# EAGLE schematic protestSign (EAGLE 6.4)

## Sheet 1 of 5
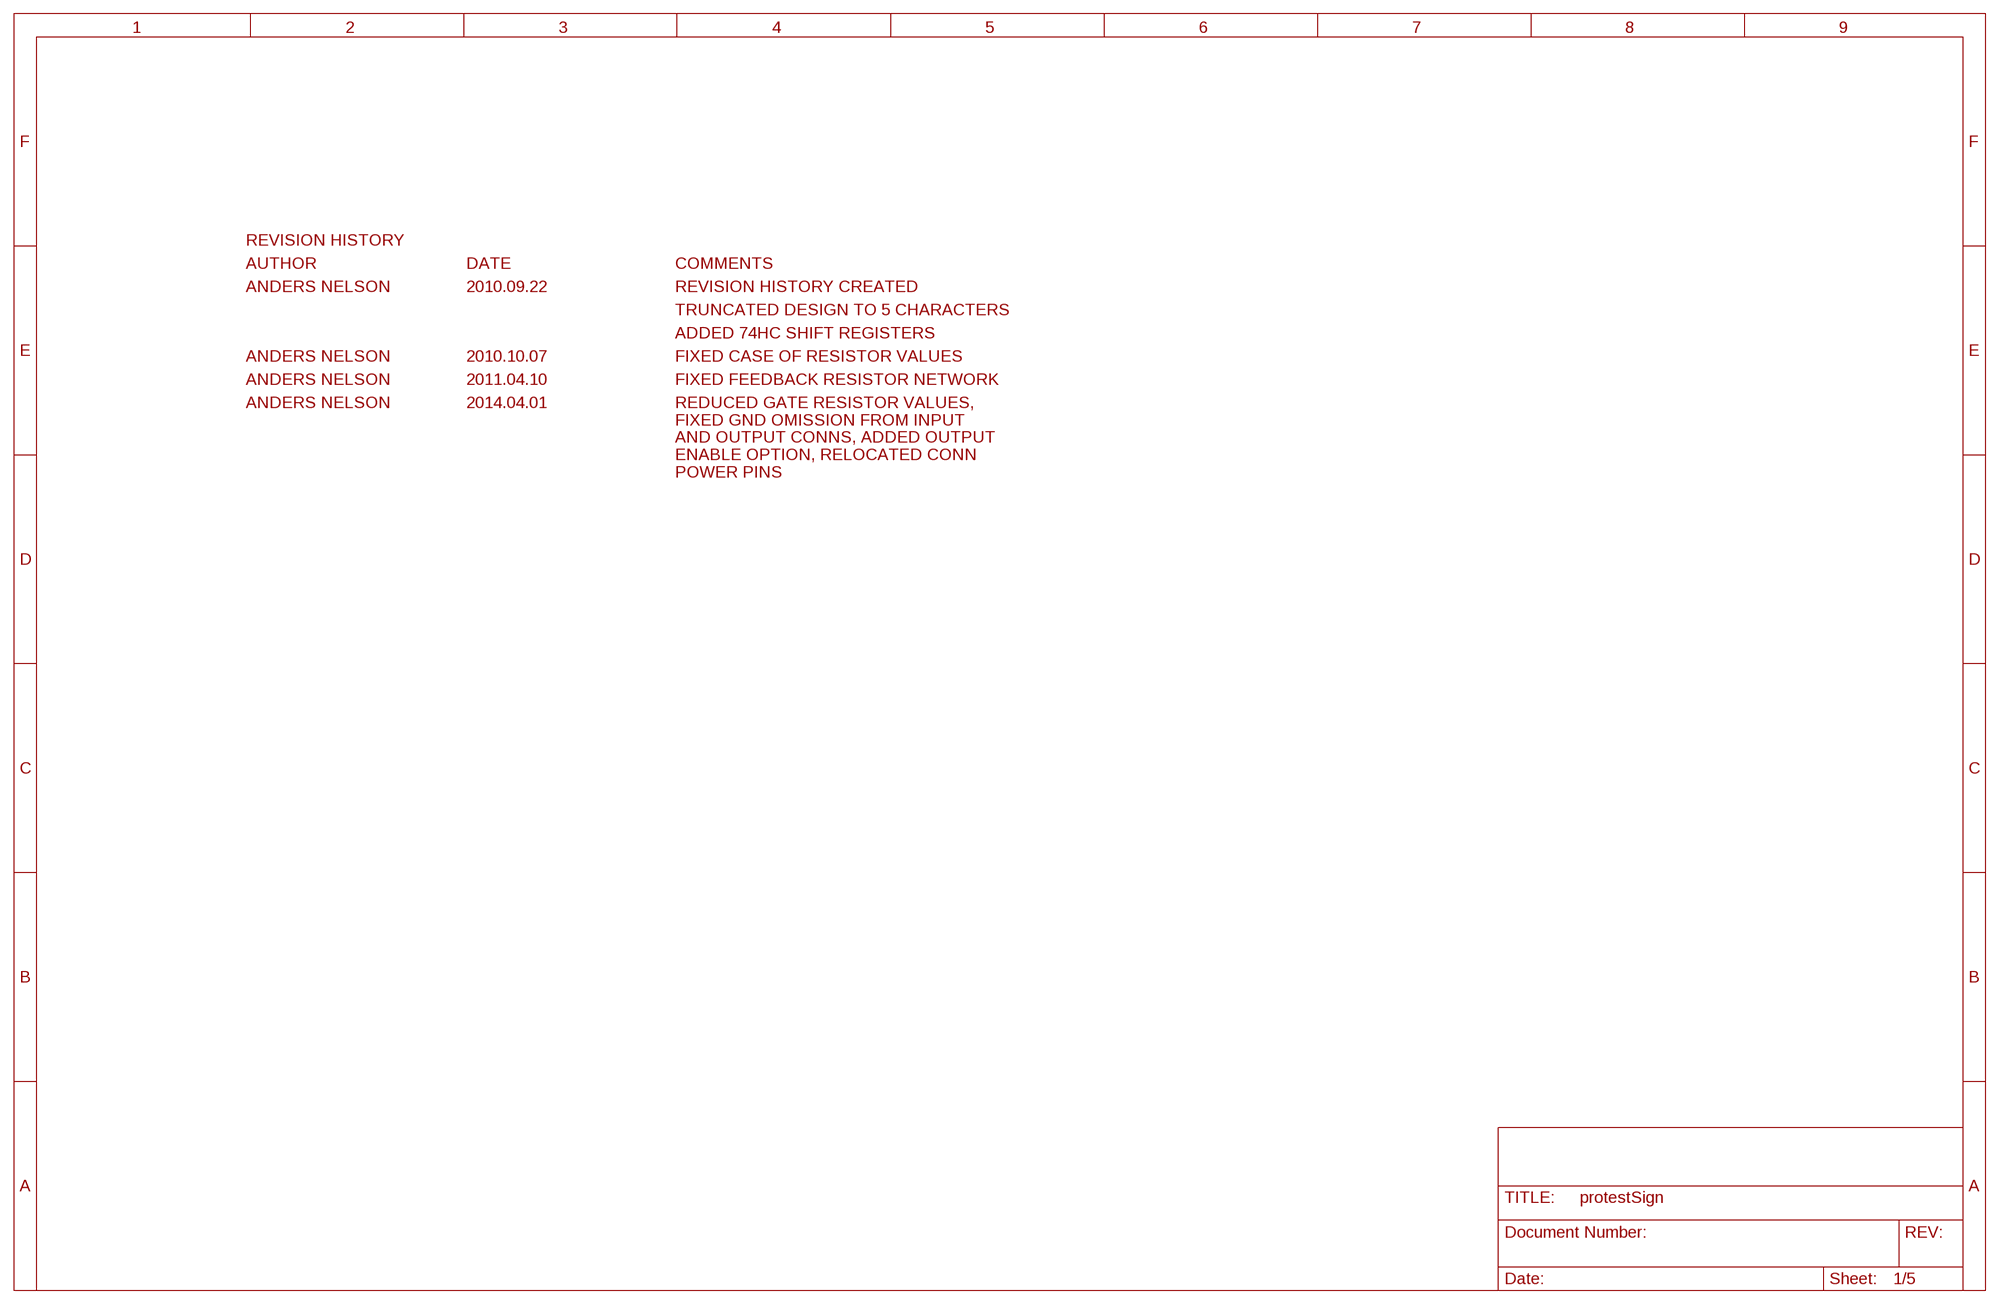
[diagram p0: schematic, sheet 1]

### Notes on the sheet
- REVISION HISTORY
- AUTHOR | DATE | COMMENTS
- ANDERS NELSON | 2010.09.22 | REVISION HISTORY CREATED
- TRUNCATED DESIGN TO 5 CHARACTERS
- ADDED 74HC SHIFT REGISTERS
- ANDERS NELSON | 2010.10.07 | FIXED CASE OF RESISTOR VALUES
- ANDERS NELSON | 2011.04.10 | FIXED FEEDBACK RESISTOR NETWORK
- ANDERS NELSON | 2014.04.01
- REDUCED GATE RESISTOR VALUES,
  FIXED GND OMISSION FROM INPUT
  AND OUTPUT CONNS, ADDED OUTPUT
  ENABLE OPTION, RELOCATED CONN
  POWER PINS

## Sheet 2 of 5
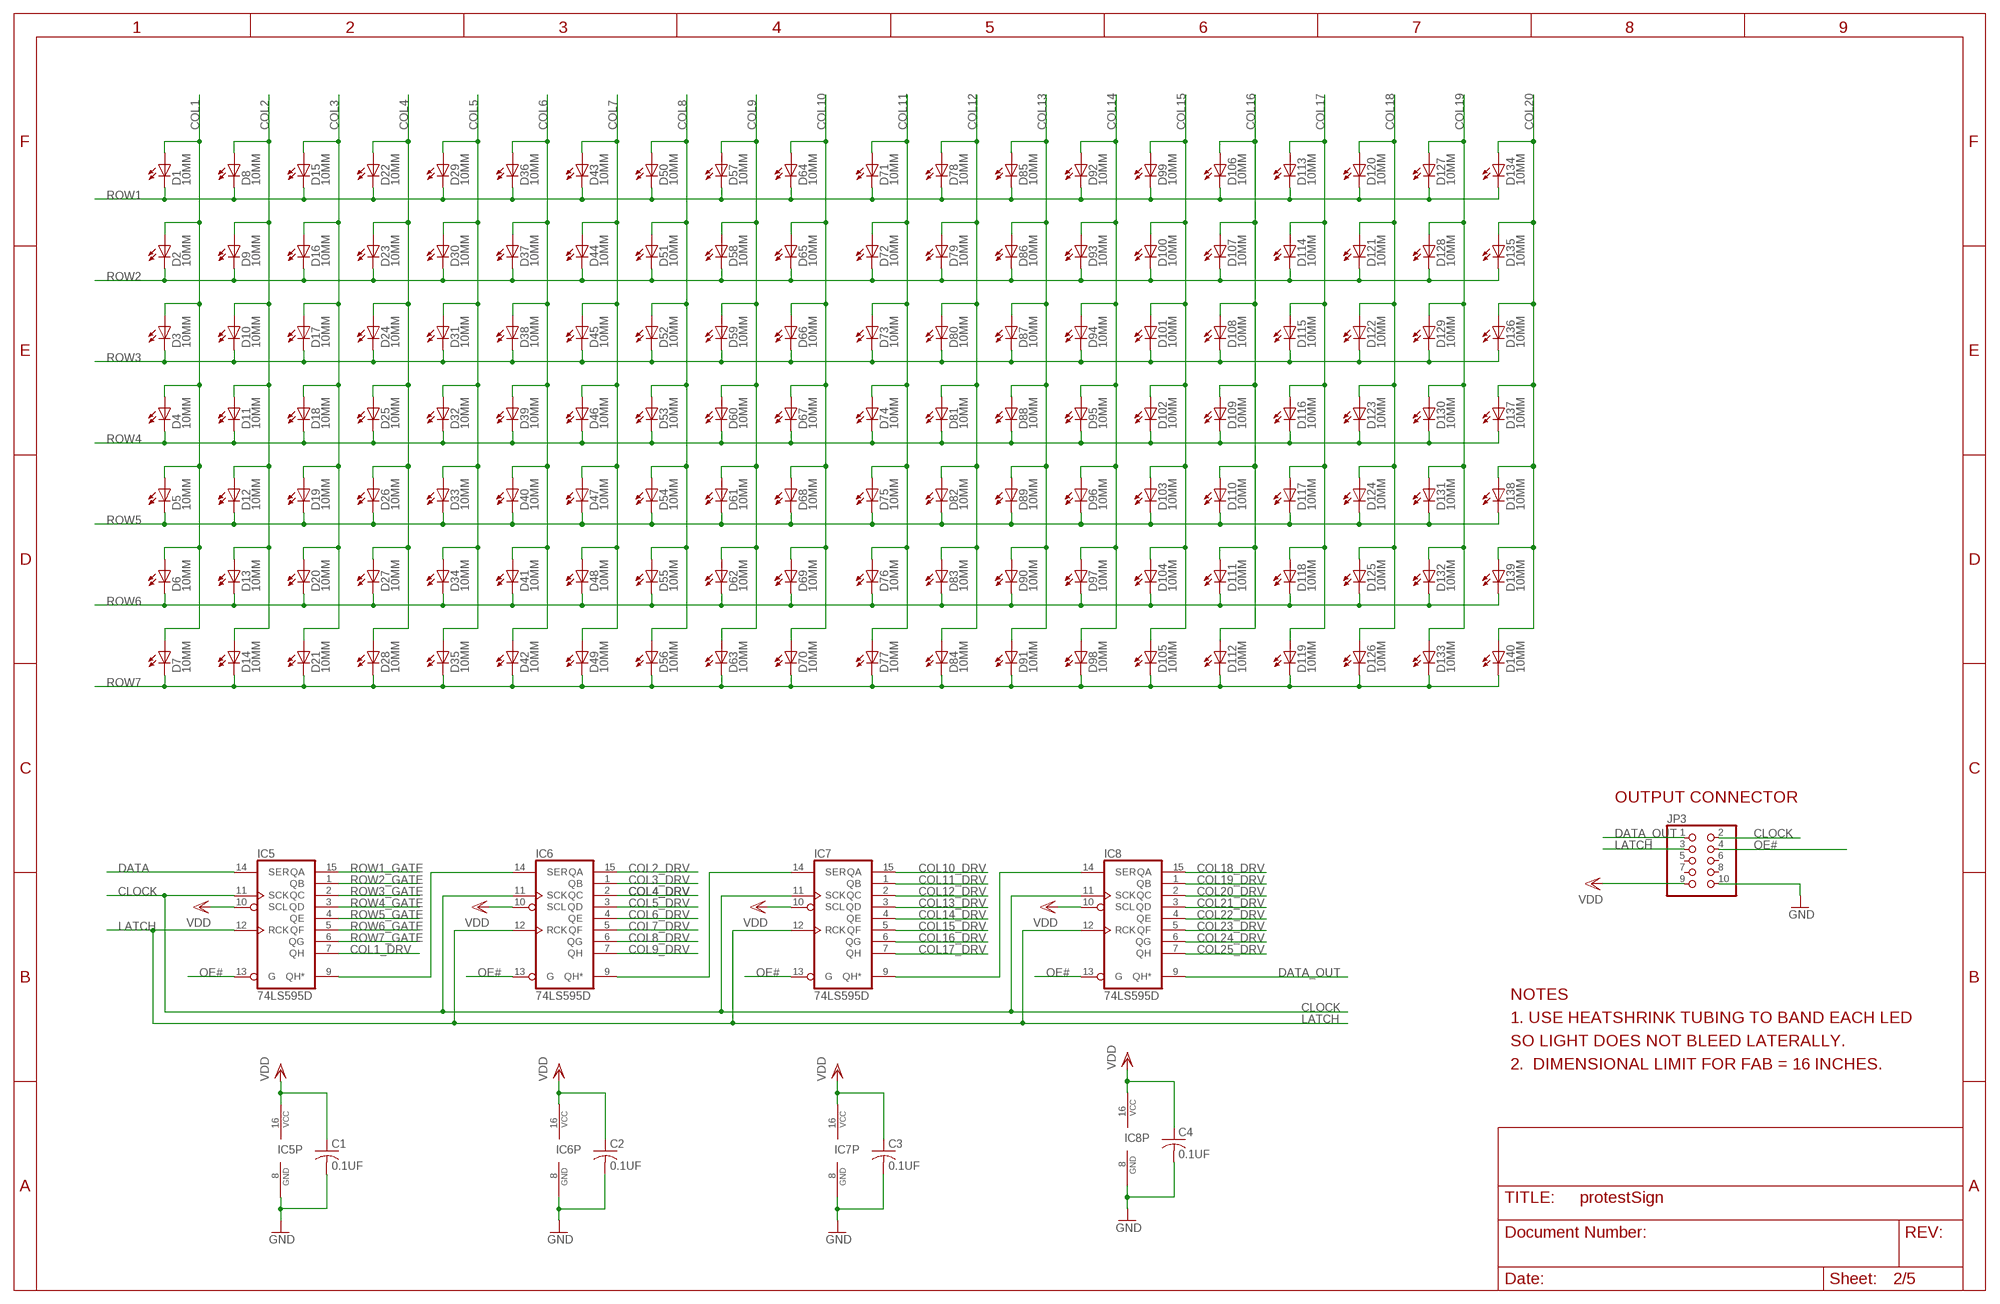
[diagram p1: schematic, sheet 2]

### Parts
C1  0.1UF  C-USC0603  [C0603]
C2  0.1UF  C-USC0603  [C0603]
C3  0.1UF  C-USC0603  [C0603]
C4  0.1UF  C-USC0603  [C0603]
D1  10MM  [LED_10MM]
D2  10MM  [LED_10MM]
D3  10MM  [LED_10MM]
D4  10MM  [LED_10MM]
D5  10MM  [LED_10MM]
D6  10MM  [LED_10MM]
D7  10MM  [LED_10MM]
D8  10MM  [LED_10MM]
D9  10MM  [LED_10MM]
D10  10MM  [LED_10MM]
D11  10MM  [LED_10MM]
D12  10MM  [LED_10MM]
D13  10MM  [LED_10MM]
D14  10MM  [LED_10MM]
D15  10MM  [LED_10MM]
D16  10MM  [LED_10MM]
D17  10MM  [LED_10MM]
D18  10MM  [LED_10MM]
D19  10MM  [LED_10MM]
D20  10MM  [LED_10MM]
D21  10MM  [LED_10MM]
D22  10MM  [LED_10MM]
D23  10MM  [LED_10MM]
D24  10MM  [LED_10MM]
D25  10MM  [LED_10MM]
D26  10MM  [LED_10MM]
D27  10MM  [LED_10MM]
D28  10MM  [LED_10MM]
D29  10MM  [LED_10MM]
D30  10MM  [LED_10MM]
D31  10MM  [LED_10MM]
D32  10MM  [LED_10MM]
D33  10MM  [LED_10MM]
D34  10MM  [LED_10MM]
D35  10MM  [LED_10MM]
D36  10MM  [LED_10MM]
D37  10MM  [LED_10MM]
D38  10MM  [LED_10MM]
D39  10MM  [LED_10MM]
D40  10MM  [LED_10MM]
D41  10MM  [LED_10MM]
D42  10MM  [LED_10MM]
D43  10MM  [LED_10MM]
D44  10MM  [LED_10MM]
D45  10MM  [LED_10MM]
D46  10MM  [LED_10MM]
D47  10MM  [LED_10MM]
D48  10MM  [LED_10MM]
D49  10MM  [LED_10MM]
D50  10MM  [LED_10MM]
D51  10MM  [LED_10MM]
D52  10MM  [LED_10MM]
D53  10MM  [LED_10MM]
D54  10MM  [LED_10MM]
D55  10MM  [LED_10MM]
D56  10MM  [LED_10MM]
D57  10MM  [LED_10MM]
D58  10MM  [LED_10MM]
D59  10MM  [LED_10MM]
D60  10MM  [LED_10MM]
D61  10MM  [LED_10MM]
D62  10MM  [LED_10MM]
D63  10MM  [LED_10MM]
D64  10MM  [LED_10MM]
D65  10MM  [LED_10MM]
D66  10MM  [LED_10MM]
D67  10MM  [LED_10MM]
D68  10MM  [LED_10MM]
D69  10MM  [LED_10MM]
D70  10MM  [LED_10MM]
D71  10MM  [LED_10MM]
D72  10MM  [LED_10MM]
D73  10MM  [LED_10MM]
D74  10MM  [LED_10MM]
D75  10MM  [LED_10MM]
D76  10MM  [LED_10MM]
D77  10MM  [LED_10MM]
D78  10MM  [LED_10MM]
D79  10MM  [LED_10MM]
D80  10MM  [LED_10MM]
D81  10MM  [LED_10MM]
D82  10MM  [LED_10MM]
D83  10MM  [LED_10MM]
D84  10MM  [LED_10MM]
D85  10MM  [LED_10MM]
D86  10MM  [LED_10MM]
D87  10MM  [LED_10MM]
D88  10MM  [LED_10MM]
D89  10MM  [LED_10MM]
D90  10MM  [LED_10MM]
D91  10MM  [LED_10MM]
D92  10MM  [LED_10MM]
D93  10MM  [LED_10MM]
D94  10MM  [LED_10MM]
D95  10MM  [LED_10MM]
D96  10MM  [LED_10MM]
D97  10MM  [LED_10MM]
D98  10MM  [LED_10MM]
D99  10MM  [LED_10MM]
D100  10MM  [LED_10MM]
D101  10MM  [LED_10MM]
D102  10MM  [LED_10MM]
D103  10MM  [LED_10MM]
D104  10MM  [LED_10MM]
D105  10MM  [LED_10MM]
D106  10MM  [LED_10MM]
D107  10MM  [LED_10MM]
D108  10MM  [LED_10MM]
D109  10MM  [LED_10MM]
D110  10MM  [LED_10MM]
D111  10MM  [LED_10MM]
D112  10MM  [LED_10MM]
D113  10MM  [LED_10MM]
D114  10MM  [LED_10MM]
D115  10MM  [LED_10MM]
D116  10MM  [LED_10MM]
D117  10MM  [LED_10MM]
D118  10MM  [LED_10MM]
D119  10MM  [LED_10MM]
D120  10MM  [LED_10MM]
D121  10MM  [LED_10MM]
D122  10MM  [LED_10MM]
D123  10MM  [LED_10MM]
D124  10MM  [LED_10MM]
D125  10MM  [LED_10MM]
D126  10MM  [LED_10MM]
D127  10MM  [LED_10MM]
D128  10MM  [LED_10MM]
D129  10MM  [LED_10MM]
D130  10MM  [LED_10MM]
D131  10MM  [LED_10MM]
D132  10MM  [LED_10MM]
D133  10MM  [LED_10MM]
D134  10MM  [LED_10MM]
D135  10MM  [LED_10MM]
D136  10MM  [LED_10MM]
D137  10MM  [LED_10MM]
D138  10MM  [LED_10MM]
D139  10MM  [LED_10MM]
D140  10MM  [LED_10MM]
IC5  74LS595D  [SO16]
IC6  74LS595D  [SO16]
IC7  74LS595D  [SO16]
IC8  74LS595D  [SO16]
JP3  PINHD-2X5  [2X05]

### Nets
CLOCK: IC5.11(SCK) IC6.11(SCK) IC7.11(SCK) IC8.11(SCK) JP3.2 ; also sheet 3
COL1: D1.A D2.A D3.A D4.A D5.A D6.A D7.A ; also sheet 4
COL1_DRV: IC5.7(QH) ; also sheet 4
COL2: D8.A D9.A D10.A D11.A D12.A D13.A D14.A ; also sheet 4
COL2_DRV: IC6.15(QA) ; also sheet 4
COL3: D15.A D16.A D17.A D18.A D19.A D20.A D21.A ; also sheet 4
COL3_DRV: IC6.1(QB) ; also sheet 4
COL4: D22.A D23.A D24.A D25.A D26.A D27.A D28.A ; also sheet 4
COL4_DRV: IC6.2(QC) ; also sheet 4
COL5: D29.A D30.A D31.A D32.A D33.A D34.A D35.A ; also sheet 4
COL5_DRV: IC6.3(QD) ; also sheet 4
COL6: D36.A D37.A D38.A D39.A D40.A D41.A D42.A ; also sheet 4
COL6_DRV: IC6.4(QE) ; also sheet 4
COL7: D43.A D44.A D45.A D46.A D47.A D48.A D49.A ; also sheet 4
COL7_DRV: IC6.5(QF) ; also sheet 4
COL8: D50.A D51.A D52.A D53.A D54.A D55.A D56.A ; also sheet 4
COL8_DRV: IC6.6(QG) ; also sheet 4
COL9: D57.A D58.A D59.A D60.A D61.A D62.A D63.A ; also sheet 4
COL9_DRV: IC6.7(QH) ; also sheet 4
COL10: D64.A D65.A D66.A D67.A D68.A D69.A D70.A ; also sheet 4
COL10_DRV: IC7.15(QA) ; also sheet 4
COL11: D71.A D72.A D73.A D74.A D75.A D76.A D77.A ; also sheet 4
COL11_DRV: IC7.1(QB) ; also sheet 4
COL12: D78.A D79.A D80.A D81.A D82.A D83.A D84.A ; also sheet 4
COL12_DRV: IC7.2(QC) ; also sheet 4
COL13: D85.A D86.A D87.A D88.A D89.A D90.A D91.A ; also sheet 4
COL13_DRV: IC7.3(QD) ; also sheet 4
COL14: D92.A D93.A D94.A D95.A D96.A D97.A D98.A ; also sheet 4
COL14_DRV: IC7.4(QE) ; also sheet 4
COL15: D99.A D100.A D101.A D102.A D103.A D104.A D105.A ; also sheet 4
COL15_DRV: IC7.5(QF) ; also sheet 4
COL16: D106.A D107.A D108.A D109.A D110.A D111.A D112.A ; also sheet 4
COL16_DRV: IC7.6(QG) ; also sheet 4
COL17: D113.A D114.A D115.A D116.A D117.A D118.A D119.A ; also sheet 4
COL17_DRV: IC7.7(QH) ; also sheet 4
COL18: D120.A D121.A D122.A D123.A D124.A D125.A D126.A ; also sheet 4
COL18_DRV: IC8.15(QA) ; also sheet 4
COL19: D127.A D128.A D129.A D130.A D131.A D132.A D133.A ; also sheet 4
COL19_DRV: IC8.1(QB) ; also sheet 4
COL20: D134.A D135.A D136.A D137.A D138.A D139.A D140.A ; also sheet 4
COL20_DRV: IC8.2(QC) ; also sheet 4
COL21_DRV: IC8.3(QD) ; also sheet 4
COL22_DRV: IC8.4(QE) ; also sheet 4
COL23_DRV: IC8.5(QF) ; also sheet 4
COL24_DRV: IC8.6(QG) ; also sheet 4
COL25_DRV: IC8.7(QH) ; also sheet 4
DATA: IC5.14(SER) ; also sheet 3
DATA_OUT: IC8.9(QH*) JP3.1
GND: C1.2 C2.2 C3.2 C4.2 IC5.8(GND) IC6.8(GND) IC7.8(GND) IC8.8(GND) JP3.10 ; also sheet 3,5
LATCH: IC5.12(RCK) IC6.12(RCK) IC7.12(RCK) IC8.12(RCK) JP3.3 ; also sheet 3
N$1: IC5.9(QH*) IC6.14(SER)
N$2: IC6.9(QH*) IC7.14(SER)
N$10: IC7.9(QH*) IC8.14(SER)
OE#: IC5.13(G) IC6.13(G) IC7.13(G) IC8.13(G) JP3.4 ; also sheet 3
ROW1: D1.C D8.C D15.C D22.C D29.C D36.C D43.C D50.C D57.C D64.C D71.C D78.C D85.C D92.C D99.C D106.C D113.C D120.C D127.C D134.C ; also sheet 3
ROW1_GATE: IC5.15(QA) ; also sheet 3
ROW2: D2.C D9.C D16.C D23.C D30.C D37.C D44.C D51.C D58.C D65.C D72.C D79.C D86.C D93.C D100.C D107.C D114.C D121.C D128.C D135.C ; also sheet 3
ROW2_GATE: IC5.1(QB) ; also sheet 3
ROW3: D3.C D10.C D17.C D24.C D31.C D38.C D45.C D52.C D59.C D66.C D73.C D80.C D87.C D94.C D101.C D108.C D115.C D122.C D129.C D136.C ; also sheet 3
ROW3_GATE: IC5.2(QC) ; also sheet 3
ROW4: D4.C D11.C D18.C D25.C D32.C D39.C D46.C D53.C D60.C D67.C D74.C D81.C D88.C D95.C D102.C D109.C D116.C D123.C D130.C D137.C ; also sheet 3
ROW4_GATE: IC5.3(QD) ; also sheet 3
ROW5: D5.C D12.C D19.C D26.C D33.C D40.C D47.C D54.C D61.C D68.C D75.C D82.C D89.C D96.C D103.C D110.C D117.C D124.C D131.C D138.C ; also sheet 3
ROW5_GATE: IC5.4(QE) ; also sheet 3
ROW6: D6.C D13.C D20.C D27.C D34.C D41.C D48.C D55.C D62.C D69.C D76.C D83.C D90.C D97.C D104.C D111.C D118.C D125.C D132.C D139.C ; also sheet 3
ROW6_GATE: IC5.5(QF) ; also sheet 3
ROW7: D7.C D14.C D21.C D28.C D35.C D42.C D49.C D56.C D63.C D70.C D77.C D84.C D91.C D98.C D105.C D112.C D119.C D126.C D133.C D140.C ; also sheet 3
ROW7_GATE: IC5.6(QG) ; also sheet 3
VDD: C1.1 C2.1 C3.1 C4.1 IC5.10(SCL) IC5.16(VCC) IC6.10(SCL) IC6.16(VCC) IC7.10(SCL) IC7.16(VCC) IC8.10(SCL) IC8.16(VCC) JP3.9 ; also sheet 3,4,5
Unconnected: JP3.5 JP3.6 JP3.7 JP3.8

### Notes on the sheet
- OUTPUT CONNECTOR
- NOTES
- 1. USE HEATSHRINK TUBING TO BAND EACH LED
- SO LIGHT DOES NOT BLEED LATERALLY.
- 2.  DIMENSIONAL LIMIT FOR FAB = 16 INCHES.

## Sheet 3 of 5
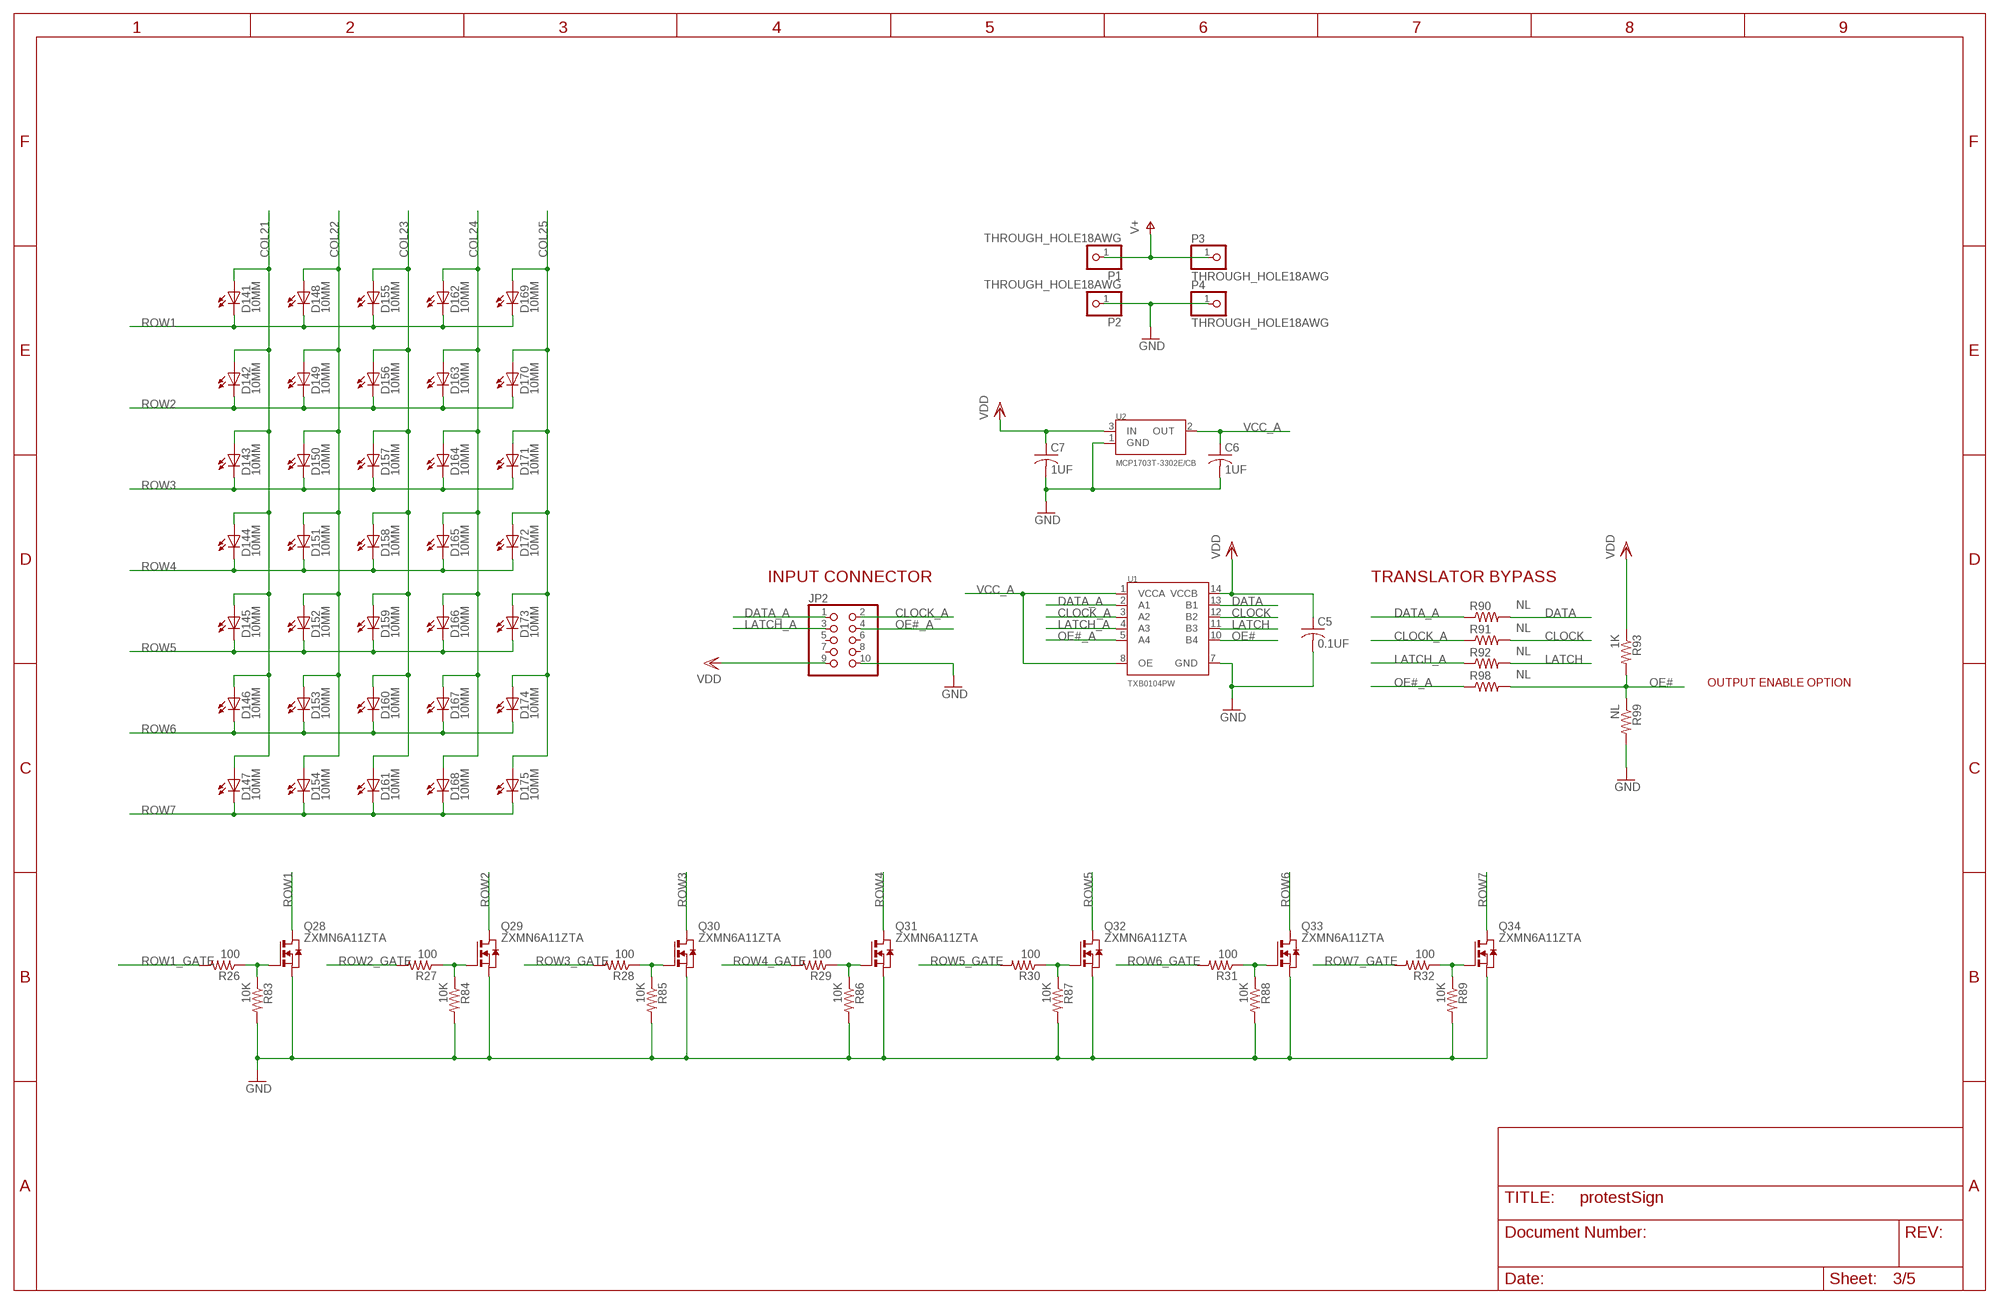
[diagram p2: schematic, sheet 3]

### Parts
C5  0.1UF  C-USC0603  [C0603]
C6  1UF  C-USC0603  [C0603]
C7  1UF  C-USC0603  [C0603]
D141  10MM  [LED_10MM]
D142  10MM  [LED_10MM]
D143  10MM  [LED_10MM]
D144  10MM  [LED_10MM]
D145  10MM  [LED_10MM]
D146  10MM  [LED_10MM]
D147  10MM  [LED_10MM]
D148  10MM  [LED_10MM]
D149  10MM  [LED_10MM]
D150  10MM  [LED_10MM]
D151  10MM  [LED_10MM]
D152  10MM  [LED_10MM]
D153  10MM  [LED_10MM]
D154  10MM  [LED_10MM]
D155  10MM  [LED_10MM]
D156  10MM  [LED_10MM]
D157  10MM  [LED_10MM]
D158  10MM  [LED_10MM]
D159  10MM  [LED_10MM]
D160  10MM  [LED_10MM]
D161  10MM  [LED_10MM]
D162  10MM  [LED_10MM]
D163  10MM  [LED_10MM]
D164  10MM  [LED_10MM]
D165  10MM  [LED_10MM]
D166  10MM  [LED_10MM]
D167  10MM  [LED_10MM]
D168  10MM  [LED_10MM]
D169  10MM  [LED_10MM]
D170  10MM  [LED_10MM]
D171  10MM  [LED_10MM]
D172  10MM  [LED_10MM]
D173  10MM  [LED_10MM]
D174  10MM  [LED_10MM]
D175  10MM  [LED_10MM]
JP2  PINHD-2X5  [2X05]
P1  THROUGH_HOLE18AWG  [18AWG_TH]
P2  THROUGH_HOLE18AWG  [18AWG_TH]
P3  THROUGH_HOLE18AWG  [18AWG_TH]
P4  THROUGH_HOLE18AWG  [18AWG_TH]
Q28  ZXMN6A11ZTA  [SOT89]
Q29  ZXMN6A11ZTA  [SOT89]
Q30  ZXMN6A11ZTA  [SOT89]
Q31  ZXMN6A11ZTA  [SOT89]
Q32  ZXMN6A11ZTA  [SOT89]
Q33  ZXMN6A11ZTA  [SOT89]
Q34  ZXMN6A11ZTA  [SOT89]
R26  100  R-US_R0603  [R0603]
R27  100  R-US_R0603  [R0603]
R28  100  R-US_R0603  [R0603]
R29  100  R-US_R0603  [R0603]
R30  100  R-US_R0603  [R0603]
R31  100  R-US_R0603  [R0603]
R32  100  R-US_R0603  [R0603]
R83  10K  R-US_R0603  [R0603]
R84  10K  R-US_R0603  [R0603]
R85  10K  R-US_R0603  [R0603]
R86  10K  R-US_R0603  [R0603]
R87  10K  R-US_R0603  [R0603]
R88  10K  R-US_R0603  [R0603]
R89  10K  R-US_R0603  [R0603]
R90  NL  R-US_R0603  [R0603]
R91  NL  R-US_R0603  [R0603]
R92  NL  R-US_R0603  [R0603]
R93  1K  R-US_R0603  [R0603]
R98  NL  R-US_R0603  [R0603]
R99  NL  R-US_R0603  [R0603]
U1  TXB0104PW  [TSSOP14]
U2  MCP1703T-3302E/CB  [SOT23]

### Nets
CLOCK: R91.2 U1.12(B2) ; also sheet 2
CLOCK_A: JP2.2 R91.1 U1.3(A2)
COL21: D141.A D142.A D143.A D144.A D145.A D146.A D147.A ; also sheet 4
COL22: D148.A D149.A D150.A D151.A D152.A D153.A D154.A ; also sheet 4
COL23: D155.A D156.A D157.A D158.A D159.A D160.A D161.A ; also sheet 4
COL24: D162.A D163.A D164.A D165.A D166.A D167.A D168.A ; also sheet 4
COL25: D169.A D170.A D171.A D172.A D173.A D174.A D175.A ; also sheet 4
DATA: R90.2 U1.13(B1) ; also sheet 2
DATA_A: JP2.1 R90.1 U1.2(A1)
GND: C5.2 C6.2 C7.2 JP2.10 P2.1 P4.1 Q28.3(S) Q29.3(S) Q30.3(S) Q31.3(S) Q32.3(S) Q33.3(S) Q34.3(S) R83.2 R84.2 R85.2 R86.2 R87.2 R88.2 R89.2 R99.2 U1.7(GND) U2.1(GND) ; also sheet 2,5
LATCH: R92.2 U1.11(B3) ; also sheet 2
LATCH_A: JP2.3 R92.1 U1.4(A3)
N$13: Q34.1(G) R32.1 R89.1
N$14: Q33.1(G) R31.1 R88.1
N$15: Q32.1(G) R30.1 R87.1
N$16: Q31.1(G) R29.1 R86.1
N$17: Q30.1(G) R28.1 R85.1
N$18: Q29.1(G) R27.1 R84.1
N$19: Q28.1(G) R26.1 R83.1
OE#: R93.2 R98.2 R99.1 U1.10(B4) ; also sheet 2
OE#_A: JP2.4 R98.1 U1.5(A4)
ROW1: D141.C D148.C D155.C D162.C D169.C Q28.2(D) ; also sheet 2
ROW1_GATE: R26.2 ; also sheet 2
ROW2: D142.C D149.C D156.C D163.C D170.C Q29.2(D) ; also sheet 2
ROW2_GATE: R27.2 ; also sheet 2
ROW3: D143.C D150.C D157.C D164.C D171.C Q30.2(D) ; also sheet 2
ROW3_GATE: R28.2 ; also sheet 2
ROW4: D144.C D151.C D158.C D165.C D172.C Q31.2(D) ; also sheet 2
ROW4_GATE: R29.2 ; also sheet 2
ROW5: D145.C D152.C D159.C D166.C D173.C Q32.2(D) ; also sheet 2
ROW5_GATE: R30.2 ; also sheet 2
ROW6: D146.C D153.C D160.C D167.C D174.C Q33.2(D) ; also sheet 2
ROW6_GATE: R31.2 ; also sheet 2
ROW7: D147.C D154.C D161.C D168.C D175.C Q34.2(D) ; also sheet 2
ROW7_GATE: R32.2 ; also sheet 2
V+: P1.1 P3.1 ; also sheet 5
VCC_A: C6.1 U1.1(VCCA) U1.8(OE) U2.2(OUT)
VDD: C5.1 C7.1 JP2.9 R93.1 U1.14(VCCB) U2.3(IN) ; also sheet 2,4,5
Unconnected: JP2.5 JP2.6 JP2.7 JP2.8

### Notes on the sheet
- INPUT CONNECTOR | TRANSLATOR BYPASS
- OUTPUT ENABLE OPTION

## Sheet 4 of 5
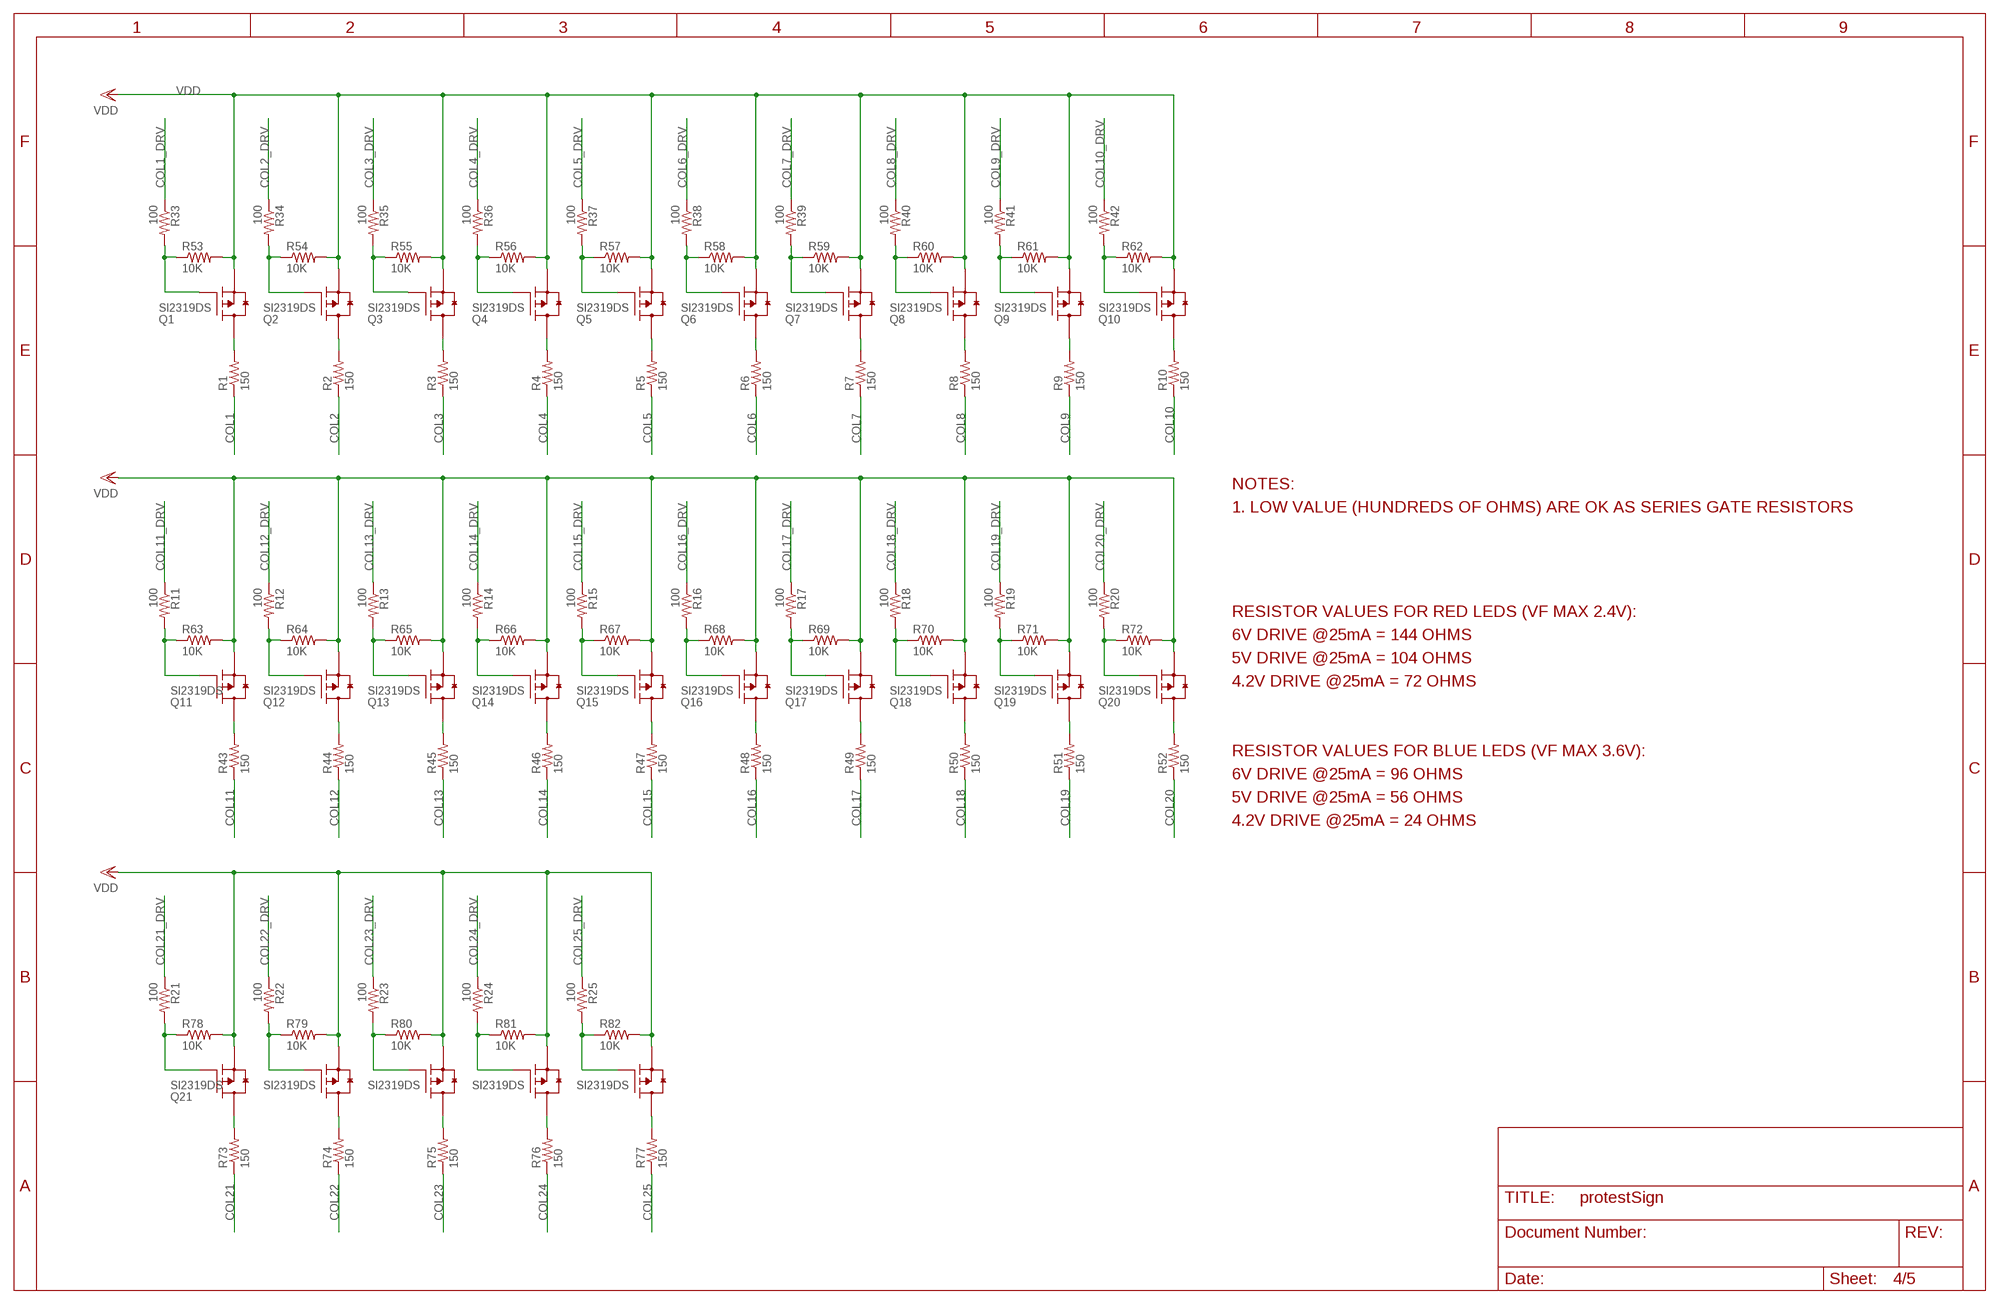
[diagram p3: schematic, sheet 4]

### Parts
Q1  SI2319DS  [SOT23]
Q2  SI2319DS  [SOT23]
Q3  SI2319DS  [SOT23]
Q4  SI2319DS  [SOT23]
Q5  SI2319DS  [SOT23]
Q6  SI2319DS  [SOT23]
Q7  SI2319DS  [SOT23]
Q8  SI2319DS  [SOT23]
Q9  SI2319DS  [SOT23]
Q10  SI2319DS  [SOT23]
Q11  SI2319DS  [SOT23]
Q12  SI2319DS  [SOT23]
Q13  SI2319DS  [SOT23]
Q14  SI2319DS  [SOT23]
Q15  SI2319DS  [SOT23]
Q16  SI2319DS  [SOT23]
Q17  SI2319DS  [SOT23]
Q18  SI2319DS  [SOT23]
Q19  SI2319DS  [SOT23]
Q20  SI2319DS  [SOT23]
Q21  SI2319DS  [SOT23]
Q22  SI2319DS  [SOT23]
Q23  SI2319DS  [SOT23]
Q24  SI2319DS  [SOT23]
Q25  SI2319DS  [SOT23]
R1  150  R-US_M0805  [M0805]
R2  150  R-US_M0805  [M0805]
R3  150  R-US_M0805  [M0805]
R4  150  R-US_M0805  [M0805]
R5  150  R-US_M0805  [M0805]
R6  150  R-US_M0805  [M0805]
R7  150  R-US_M0805  [M0805]
R8  150  R-US_M0805  [M0805]
R9  150  R-US_M0805  [M0805]
R10  150  R-US_M0805  [M0805]
R11  100  R-US_R0603  [R0603]
R12  100  R-US_R0603  [R0603]
R13  100  R-US_R0603  [R0603]
R14  100  R-US_R0603  [R0603]
R15  100  R-US_R0603  [R0603]
R16  100  R-US_R0603  [R0603]
R17  100  R-US_R0603  [R0603]
R18  100  R-US_R0603  [R0603]
R19  100  R-US_R0603  [R0603]
R20  100  R-US_R0603  [R0603]
R21  100  R-US_R0603  [R0603]
R22  100  R-US_R0603  [R0603]
R23  100  R-US_R0603  [R0603]
R24  100  R-US_R0603  [R0603]
R25  100  R-US_R0603  [R0603]
R33  100  R-US_R0603  [R0603]
R34  100  R-US_R0603  [R0603]
R35  100  R-US_R0603  [R0603]
R36  100  R-US_R0603  [R0603]
R37  100  R-US_R0603  [R0603]
R38  100  R-US_R0603  [R0603]
R39  100  R-US_R0603  [R0603]
R40  100  R-US_R0603  [R0603]
R41  100  R-US_R0603  [R0603]
R42  100  R-US_R0603  [R0603]
R43  150  R-US_M0805  [M0805]
R44  150  R-US_M0805  [M0805]
R45  150  R-US_M0805  [M0805]
R46  150  R-US_M0805  [M0805]
R47  150  R-US_M0805  [M0805]
R48  150  R-US_M0805  [M0805]
R49  150  R-US_M0805  [M0805]
R50  150  R-US_M0805  [M0805]
R51  150  R-US_M0805  [M0805]
R52  150  R-US_M0805  [M0805]
R53  10K  R-US_R0603  [R0603]
R54  10K  R-US_R0603  [R0603]
R55  10K  R-US_R0603  [R0603]
R56  10K  R-US_R0603  [R0603]
R57  10K  R-US_R0603  [R0603]
R58  10K  R-US_R0603  [R0603]
R59  10K  R-US_R0603  [R0603]
R60  10K  R-US_R0603  [R0603]
R61  10K  R-US_R0603  [R0603]
R62  10K  R-US_R0603  [R0603]
R63  10K  R-US_R0603  [R0603]
R64  10K  R-US_R0603  [R0603]
R65  10K  R-US_R0603  [R0603]
R66  10K  R-US_R0603  [R0603]
R67  10K  R-US_R0603  [R0603]
R68  10K  R-US_R0603  [R0603]
R69  10K  R-US_R0603  [R0603]
R70  10K  R-US_R0603  [R0603]
R71  10K  R-US_R0603  [R0603]
R72  10K  R-US_R0603  [R0603]
R73  150  R-US_M0805  [M0805]
R74  150  R-US_M0805  [M0805]
R75  150  R-US_M0805  [M0805]
R76  150  R-US_M0805  [M0805]
R77  150  R-US_M0805  [M0805]
R78  10K  R-US_R0603  [R0603]
R79  10K  R-US_R0603  [R0603]
R80  10K  R-US_R0603  [R0603]
R81  10K  R-US_R0603  [R0603]
R82  10K  R-US_R0603  [R0603]

### Nets
COL1: R1.1 ; also sheet 2
COL1_DRV: R33.1 ; also sheet 2
COL2: R2.1 ; also sheet 2
COL2_DRV: R34.1 ; also sheet 2
COL3: R3.1 ; also sheet 2
COL3_DRV: R35.1 ; also sheet 2
COL4: R4.1 ; also sheet 2
COL4_DRV: R36.1 ; also sheet 2
COL5: R5.1 ; also sheet 2
COL5_DRV: R37.1 ; also sheet 2
COL6: R6.1 ; also sheet 2
COL6_DRV: R38.1 ; also sheet 2
COL7: R7.1 ; also sheet 2
COL7_DRV: R39.1 ; also sheet 2
COL8: R8.1 ; also sheet 2
COL8_DRV: R40.1 ; also sheet 2
COL9: R9.1 ; also sheet 2
COL9_DRV: R41.1 ; also sheet 2
COL10: R10.1 ; also sheet 2
COL10_DRV: R42.1 ; also sheet 2
COL11: R43.1 ; also sheet 2
COL11_DRV: R11.1 ; also sheet 2
COL12: R44.1 ; also sheet 2
COL12_DRV: R12.1 ; also sheet 2
COL13: R45.1 ; also sheet 2
COL13_DRV: R13.1 ; also sheet 2
COL14: R46.1 ; also sheet 2
COL14_DRV: R14.1 ; also sheet 2
COL15: R47.1 ; also sheet 2
COL15_DRV: R15.1 ; also sheet 2
COL16: R48.1 ; also sheet 2
COL16_DRV: R16.1 ; also sheet 2
COL17: R49.1 ; also sheet 2
COL17_DRV: R17.1 ; also sheet 2
COL18: R50.1 ; also sheet 2
COL18_DRV: R18.1 ; also sheet 2
COL19: R51.1 ; also sheet 2
COL19_DRV: R19.1 ; also sheet 2
COL20: R52.1 ; also sheet 2
COL20_DRV: R20.1 ; also sheet 2
COL21: R73.1 ; also sheet 3
COL21_DRV: R21.1 ; also sheet 2
COL22: R74.1 ; also sheet 3
COL22_DRV: R22.1 ; also sheet 2
COL23: R75.1 ; also sheet 3
COL23_DRV: R23.1 ; also sheet 2
COL24: R76.1 ; also sheet 3
COL24_DRV: R24.1 ; also sheet 2
COL25: R77.1 ; also sheet 3
COL25_DRV: R25.1 ; also sheet 2
N$4: Q1.1(G) R33.2 R53.1
N$5: Q11.1(G) R11.2 R63.1
N$6: Q2.1(G) R34.2 R54.1
N$7: Q12.1(G) R12.2 R64.1
N$8: Q13.1(G) R13.2 R65.1
N$9: Q14.1(G) R14.2 R66.1
N$11: Q15.1(G) R15.2 R67.1
N$12: Q16.1(G) R16.2 R68.1
N$20: Q17.1(G) R17.2 R69.1
N$21: Q18.1(G) R18.2 R70.1
N$22: Q19.1(G) R19.2 R71.1
N$23: Q20.1(G) R20.2 R72.1
N$24: Q11.3(D) R43.2
N$25: Q12.3(D) R44.2
N$26: Q13.3(D) R45.2
N$27: Q14.3(D) R46.2
N$28: Q15.3(D) R47.2
N$29: Q16.3(D) R48.2
N$30: Q17.3(D) R49.2
N$31: Q18.3(D) R50.2
N$32: Q19.3(D) R51.2
N$33: Q20.3(D) R52.2
N$34: Q21.1(G) R21.2 R78.1
N$35: Q22.1(G) R22.2 R79.1
N$36: Q23.1(G) R23.2 R80.1
N$37: Q24.1(G) R24.2 R81.1
N$38: Q25.1(G) R25.2 R82.1
N$39: Q21.3(D) R73.2
N$41: Q22.3(D) R74.2
N$42: Q3.1(G) R35.2 R55.1
N$43: Q4.1(G) R36.2 R56.1
N$44: Q5.1(G) R37.2 R57.1
N$45: Q6.1(G) R38.2 R58.1
N$46: Q7.1(G) R39.2 R59.1
N$47: Q8.1(G) R40.2 R60.1
N$48: Q9.1(G) R41.2 R61.1
N$49: Q10.1(G) R42.2 R62.1
N$50: Q1.3(D) R1.2
N$51: Q2.3(D) R2.2
N$52: Q3.3(D) R3.2
N$53: Q4.3(D) R4.2
N$54: Q5.3(D) R5.2
N$55: Q6.3(D) R6.2
N$56: Q7.3(D) R7.2
N$57: Q8.3(D) R8.2
N$58: Q9.3(D) R9.2
N$59: Q10.3(D) R10.2
N$60: Q23.3(D) R75.2
N$61: Q24.3(D) R76.2
N$62: Q25.3(D) R77.2
VDD: Q1.2(S) Q2.2(S) Q3.2(S) Q4.2(S) Q5.2(S) Q6.2(S) Q7.2(S) Q8.2(S) Q9.2(S) Q10.2(S) Q11.2(S) Q12.2(S) Q13.2(S) Q14.2(S) Q15.2(S) Q16.2(S) Q17.2(S) Q18.2(S) Q19.2(S) Q20.2(S) Q21.2(S) Q22.2(S) Q23.2(S) Q24.2(S) Q25.2(S) R53.2 R54.2 R55.2 R56.2 R57.2 R58.2 R59.2 R60.2 R61.2 R62.2 R63.2 R64.2 R65.2 R66.2 R67.2 R68.2 R69.2 R70.2 R71.2 R72.2 R78.2 R79.2 R80.2 R81.2 R82.2 ; also sheet 2,3,5

### Notes on the sheet
- NOTES:
- 1. LOW VALUE (HUNDREDS OF OHMS) ARE OK AS SERIES GATE RESISTORS
- RESISTOR VALUES FOR RED LEDS (VF MAX 2.4V):
- 6V DRIVE @25mA = 144 OHMS
- 5V DRIVE @25mA = 104 OHMS
- 4.2V DRIVE @25mA = 72 OHMS
- RESISTOR VALUES FOR BLUE LEDS (VF MAX 3.6V):
- 6V DRIVE @25mA = 96 OHMS
- 5V DRIVE @25mA = 56 OHMS
- 4.2V DRIVE @25mA = 24 OHMS

## Sheet 5 of 5
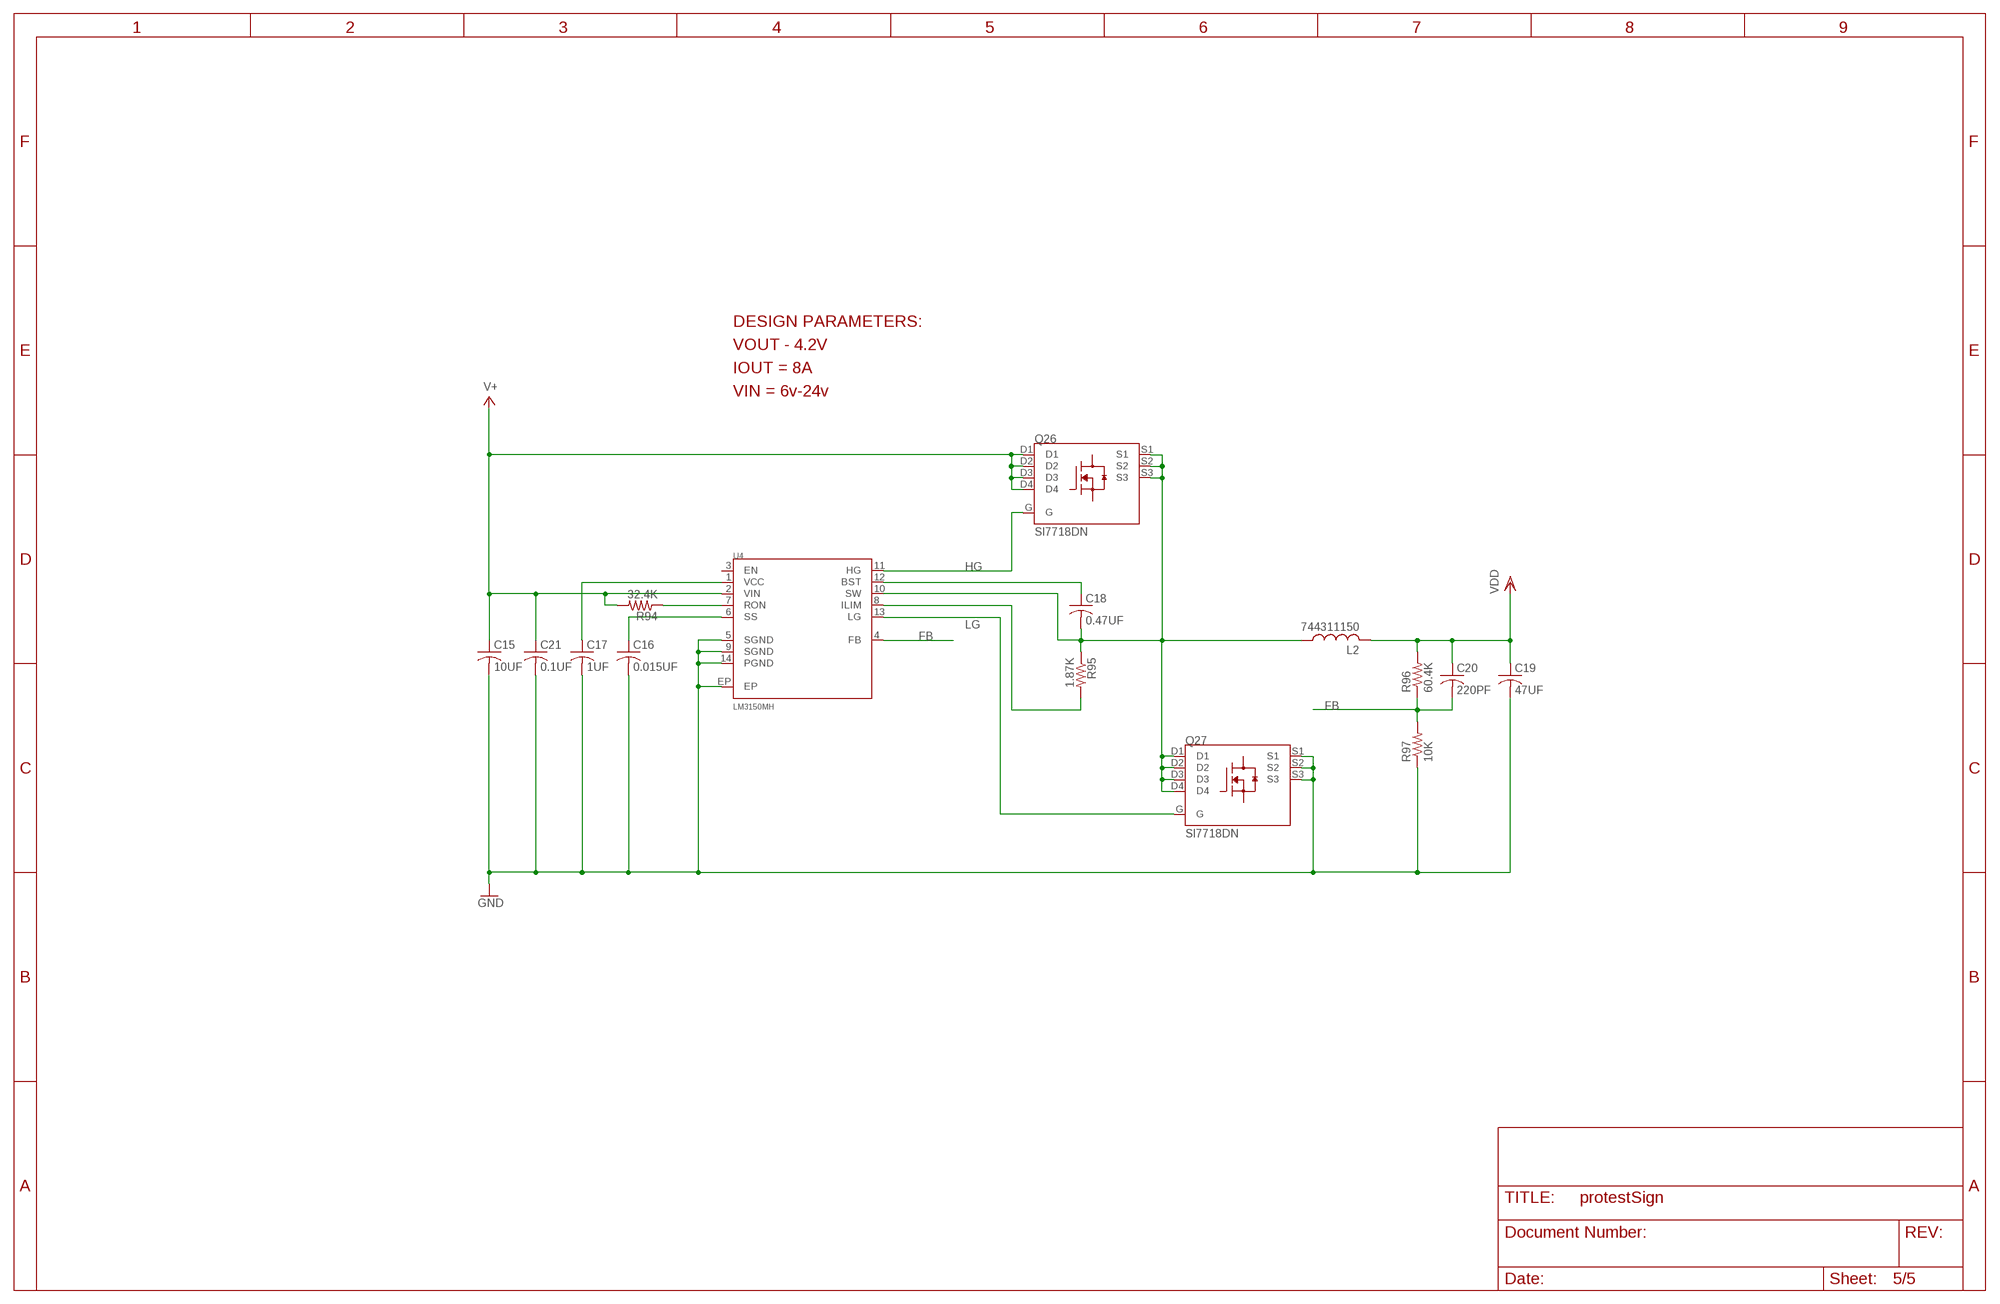
[diagram p4: schematic, sheet 5]

### Parts
C15  10UF  C-USC1210  [C1210]
C16  0.015UF  C-USC0603  [C0603]
C17  1UF  C-USC0603  [C0603]
C18  0.47UF  C-USC0603  [C0603]
C19  47UF  C-USC1210  [C1210]
C20  220PF  C-USC0603  [C0603]
C21  0.1UF  C-USC0603  [C0603]
L2  744311150  [744311150]
Q26  SI7718DN  [POWERPAK_1212_8]
Q27  SI7718DN  [POWERPAK_1212_8]
R94  32.4K  R-US_R0603  [R0603]
R95  1.87K  R-US_R0603  [R0603]
R96  60.4K  R-US_R0603  [R0603]
R97  10K  R-US_R0603  [R0603]
U4  LM3150MH  [TSSOP14_EP]

### Nets
FB: C20.2 R96.1 R97.2 U4.4(FB)
GND: C15.2 C16.2 C17.2 C19.2 C21.2 Q27.S1 Q27.S2 Q27.S3 R97.1 U4.5(SGND) U4.9(SGND) U4.14(PGND) U4.EP ; also sheet 2,3
HG: Q26.G U4.11(HG)
LG: Q27.G U4.13(LG)
N$63: R94.1 U4.7(RON)
N$65: C16.1 U4.6(SS)
N$68: C17.1 U4.1(VCC)
N$69: C18.1 U4.12(BST)
N$70: R95.2 U4.8(ILIM)
SW: C18.2 L2.P$1 Q26.S1 Q26.S2 Q26.S3 Q27.D1 Q27.D2 Q27.D3 Q27.D4 R95.1 U4.10(SW)
V+: C15.1 C21.1 Q26.D1 Q26.D2 Q26.D3 Q26.D4 R94.2 U4.2(VIN) ; also sheet 3
VDD: C19.1 C20.1 L2.P$2 R96.2 ; also sheet 2,3,4
Unconnected: U4.3(EN)

### Notes on the sheet
- DESIGN PARAMETERS:
- VOUT - 4.2V
- IOUT = 8A
- VIN = 6v-24v

## Library data of the parts
C1-C7 C15-C21 = rcl:C-US: CAPACITOR, American symbol
D1-D175 = protestSign:10MM
IC5-IC8 = 74xx-us:74*595: 8-bit SHIFT REGISTER, output latch
JP2 JP3 = pinhead:PINHD-2X5: PIN HEADER
L2 = raveGearLocalPower:744311150
P1-P4 = raveGearPowerDistro:THROUGH_HOLE
Q1-Q25 = protestSign:SI2319DS*
Q26 Q27 = raveGearLocalPower:SI7718DN
Q28-Q34 = protestSign:ZXMN6A11Z*
R1-R99 = rcl:R-US_: RESISTOR, American symbol
U1 = protestSign:TXB0104*
U2 = raveGearControl:MCP1703*
U4 = raveGearLocalPower:LM3150MH*